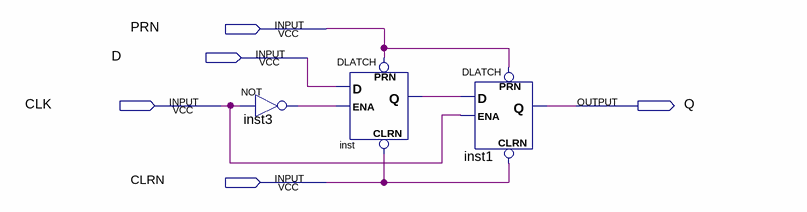
[diagram p0: schematic sheet]
// Quartus schematic Shameem_03132022_DFlipFlopMasterSlave.bdf as structural Verilog: 3 symbols, 5 pins
module Shameem_03132022_DFlipFlopMasterSlave (
  input  PRN,
  input  D,
  input  CLK,
  input  CLRN,
  output Q
);

  wire inst3_out, inst_q;

  not inst3 (inst3_out, CLK);
  DLATCH inst (.CLRN(CLRN), .D(D), .ENA(inst3_out), .PRN(PRN), .Q(inst_q));
  DLATCH inst1 (.CLRN(CLRN), .D(inst_q), .ENA(CLK), .PRN(PRN), .Q(Q));
endmodule
